# Altium schematic sheet SRAM_256Kx32_TSOP44_1.SchDoc: 256K x 32 SRAM - TSOP44 x 2
size A4; Organization: Altium Limited.; Address1: Level 3, 12a Rodborough Rd; Address2: Frenchs Forest 2086; Address3: NSW; Address4: AUSTRALIA; Revision: 6; SheetNumber: 7; SheetTotal: 64; PageSetup: Record=PageOptions|CenterHorizontal=True|CenterVertical=True|PrintScale=0.97|XCorrection=1.00|YCorrection=1.00|PrintKind=0|BorderSize=5000000|LeftOffset=0|BottomOffset=0|Orientation=2|PaperLength=1000|PaperWidth=1000|Scale=100|PaperSource=7|PrintQuality=-4|MediaType=1|DitherType=10|PaperKind=A4 (210 x 297mm)|PrintScaleMode=1
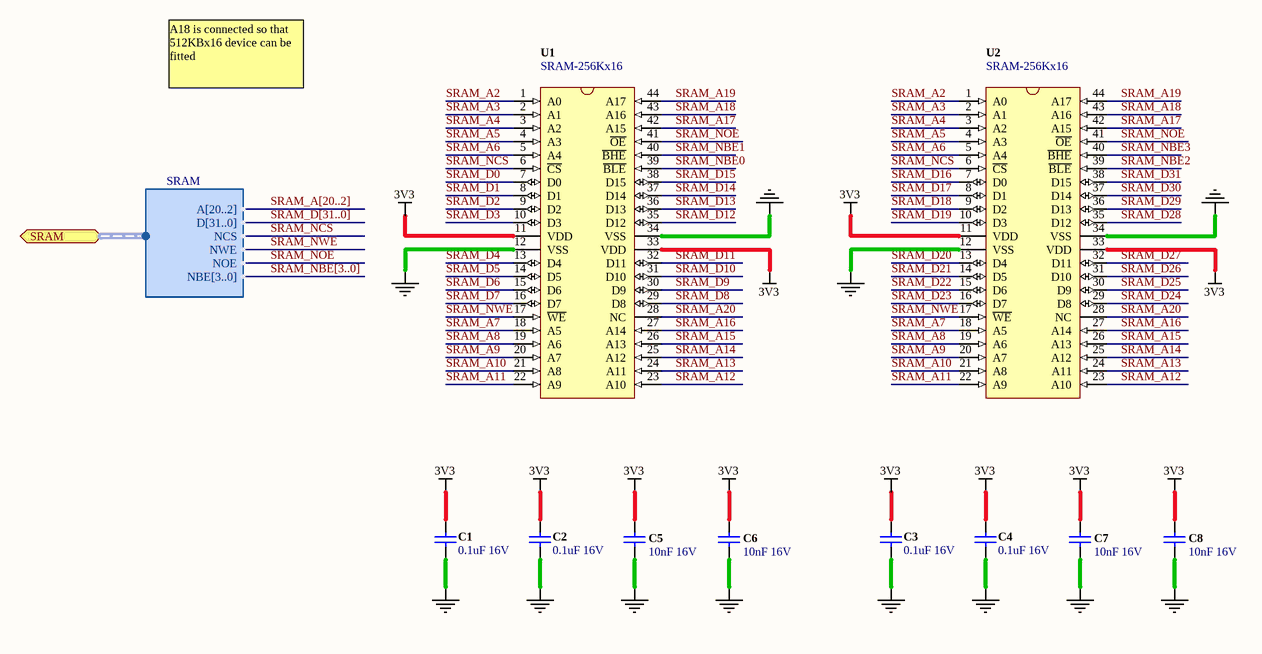
[diagram p0: SRAM_256Kx32_TSOP44_1.SchDoc]

## Parts
C1  0.1uF 16V  [CAPC1005-STAR]
C2  0.1uF 16V  [CAPC1005-STAR]
C3  0.1uF 16V  [CAPC1005-STAR]
C4  0.1uF 16V  [CAPC1005-STAR]
C5  10nF 16V  [CAPC1005-STAR]
C6  10nF 16V  [CAPC1005-STAR]
C7  10nF 16V  [CAPC1005-STAR]
C8  10nF 16V  [CAPC1005-STAR]
U1  SRAM-256Kx16  [TSOP80P1176-44]
U2  SRAM-256Kx16  [TSOP80P1176-44]

## Ports
SRAM (harness SRAM)

## Harnesses
SRAM: A[20..2], D[31..0], NCS, NWE, NOE, NBE[3..0]

## Nets
3V3: C1.1 C2.1 C3.1 C4.1 C5.1 C6.1 C7.1 C8.1 U1.11(VDD) U1.33(VDD) U2.11(VDD) U2.33(VDD)
GND: C1.2 C2.2 C3.2 C4.2 C5.2 C6.2 C7.2 C8.2 U1.12(VSS) U1.34(VSS) U2.12(VSS) U2.34(VSS)
SRAM_A2: U1.1(A0) U2.1(A0)
SRAM_A3: U1.2(A1) U2.2(A1)
SRAM_A4: U1.3(A2) U2.3(A2)
SRAM_A5: U1.4(A3) U2.4(A3)
SRAM_A6: U1.5(A4) U2.5(A4)
SRAM_A7: U1.18(A5) U2.18(A5)
SRAM_A8: U1.19(A6) U2.19(A6)
SRAM_A9: U1.20(A7) U2.20(A7)
SRAM_A10: U1.21(A8) U2.21(A8)
SRAM_A11: U1.22(A9) U2.22(A9)
SRAM_A12: U1.23(A10) U2.23(A10)
SRAM_A13: U1.24(A11) U2.24(A11)
SRAM_A14: U1.25(A12) U2.25(A12)
SRAM_A15: U1.26(A13) U2.26(A13)
SRAM_A16: U1.27(A14) U2.27(A14)
SRAM_A17: U1.42(A15) U2.42(A15)
SRAM_A18: U1.43(A16) U2.43(A16)
SRAM_A19: U1.44(A17) U2.44(A17)
SRAM_A20: U1.28(NC) U2.28(NC)
SRAM_D0: U1.7(D0)
SRAM_D1: U1.8(D1)
SRAM_D2: U1.9(D2)
SRAM_D3: U1.10(D3)
SRAM_D4: U1.13(D4)
SRAM_D5: U1.14(D5)
SRAM_D6: U1.15(D6)
SRAM_D7: U1.16(D7)
SRAM_D8: U1.29(D8)
SRAM_D9: U1.30(D9)
SRAM_D10: U1.31(D10)
SRAM_D11: U1.32(D11)
SRAM_D12: U1.35(D12)
SRAM_D13: U1.36(D13)
SRAM_D14: U1.37(D14)
SRAM_D15: U1.38(D15)
SRAM_D16: U2.7(D0)
SRAM_D17: U2.8(D1)
SRAM_D18: U2.9(D2)
SRAM_D19: U2.10(D3)
SRAM_D20: U2.13(D4)
SRAM_D21: U2.14(D5)
SRAM_D22: U2.15(D6)
SRAM_D23: U2.16(D7)
SRAM_D24: U2.29(D8)
SRAM_D25: U2.30(D9)
SRAM_D26: U2.31(D10)
SRAM_D27: U2.32(D11)
SRAM_D28: U2.35(D12)
SRAM_D29: U2.36(D13)
SRAM_D30: U2.37(D14)
SRAM_D31: U2.38(D15)
SRAM_NBE0: U1.39(~{BLE})
SRAM_NBE1: U1.40(~{BHE})
SRAM_NBE2: U2.39(~{BLE})
SRAM_NBE3: U2.40(~{BHE})
SRAM_NCS: U1.6(~{CS}) U2.6(~{CS}) ; port SRAM.NCS
SRAM_NOE: U1.41(~{OE}) U2.41(~{OE}) ; port SRAM.NOE
SRAM_NWE: U1.17(~{WE}) U2.17(~{WE}) ; port SRAM.NWE

## Buses and harness runs
bus SRAM_A[20..2]
bus SRAM_D[31..0]
bus SRAM_NBE[3..0]

## Notes on the sheet
- A18 is connected so that 512KBx16 device can be fitted
- Sheet Title
- Project Title
- Size:
- Date:
- A4
- Assy:
- Time:
- Sheet
- Revision:
- of
- File:

## Library data of the parts
C1-C4 = D-101-0080: Capacitor, Ceramic, 0.1uF 10% 16V 0402 (1005) X7R; Polarity: Non-Polarized; Category: Capacitor; Status: Production; Capacitance: 0.1 uF; Dielectric: X7R; Mounting Technology: Surface Mount; Rated Voltage: 16 V; Technology: Ceramic; Tolerance: 10 %
C5-C8 = D-101-0077: Capacitor, Ceramic, 10nF 10% 16V 0402 (1005) X7R; Polarity: Non-Polarized; Category: Capacitor; Status: Production; Capacitance: 10 nF; Dielectric: X7R; Mounting Technology: Surface Mount; Rated Voltage: 16 V; Technology: Ceramic; Tolerance: 10 %
U1 U2 = D-260-0000: K6R4016V1D-TC10T, 256K x 16-Bit SRAM, TSOP44; Bit Length: 256K Bits; Bit Width: 16 Bits; Speed: ps; Supply Voltage: 3.3 V; Category: IC-SRAM; Status: Production; Mounting Technology: Surface Mount